# Altium schematic sheet hv_can.SchDoc: AcroIQ HV LED: CAN Interface
size A4; DocumentNumber: 3; Revision: A; SheetNumber: 4; SheetTotal: 4
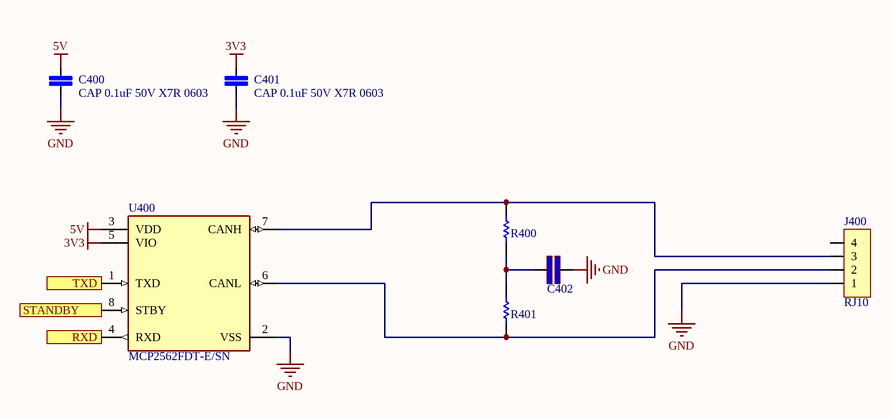
[diagram p0: hv_can.SchDoc]

## Parts
C400  CAP 0.1uF 50V X7R 0603  [FP-CL10-IPC_B]
C401  CAP 0.1uF 50V X7R 0603  [FP-CL10-IPC_B]
C402  CAP 4.7uF 50V X7R 1210  [CAPC3225X20N]  (value not drawn)
J400  RJ10  [0432024101]
R400  62R 1206 5%  [RESC3116X65X40ML10T20]  (value not drawn)
R401  62R 1206 5%  [RESC3116X65X40ML10T20]  (value not drawn)
U400  MCP2562FDT-E/SN  [FP-C04-057-SN-MFG]

## Ports
RXD, STANDBY, TXD

## Nets
3V3: C401.1 U400.5(VIO)
5V: C400.1 U400.3(VDD)
GND: C400.2 C401.2 C402.1 J400.1 U400.2(VSS)
RXD: U400.4(RXD) ; port RXD
STANDBY: U400.8(STBY) ; port STANDBY
TXD: U400.1(TXD) ; port TXD
NetC402_2: C402.2 R400.1 R401.2
NetJ400_2: J400.2 R401.1 U400.6(CANL)
NetJ400_3: J400.3 R400.2 U400.7(CANH)

Not connected (* = marked no-connect by the designer): J400 4

## Notes on the sheet
- Title
- Size:
- Date:
- A4
- Number:
- Time:
- Revision:
- Sheet
- of
- github.com/blueacro
- blueacro.com
- CERN OHL v1.2
- Made available under the
- File:
- © 2021 StackFoundry LLC. All Rights Reserved.

## Library data of the parts
C400 C401 = CMP-001-00084-4: Cap Ceramic 0.1uF 50V X7R 20% SMD 0603 125C Paper T/R
C402 = CMP-001-00083-2: CAP CER 4.7UF 50V X7R 1210; Tolerance: 10%; Material: Ceramic; Height: 1.8mm; Capacitance: 4.7uF; Contact Plating: Tin; Length: 3.2mm; Mount: Surface Mount; Dielectric: X7R; Case Code (Imperial): 1210; Min Operating Temperature: -55°C; Radiation Hardening: No; Lead Free: Lead Free; Max Operating Temperature: 125°C; Width: 0.098inch; Thickness: 0.079inch; Case/Package: 1210; Voltage Rating: 50V; Case Code (Metric): 3225; Voltage: 50V; Package Quantity: 1; Packaging: Tape and Reel; Depth: 2.5mm
J400 = CMP-167-0000-3: Modular Connectors / Ethernet Connectors RA 4/4 PORT 1 low profile; Number of Contacts: 4; Shielding: Unshielded; Connector Type: PCB; Pitch: 2.54mm; Current Rating: 1.5A; Number of Ports: 1; Contact Resistance: 10mR; Voltage Rating (DC): 125V; Glow Wire Compliant: Compliant; Gender: Female; Number of Circuits: 4; Orientation: Right Angle; Contact Material: Bronze; Number of Positions Loaded: 4; Length: 11.18mm; Min Operating Temperature: -40°C; Termination: Through Hole; Depth: 18.03mm; REACH SVHC: Unknown; Contact Plating: Gold; Number of Terminals: 4; Lead Free: Lead Free; Color: Black; Radiation Hardening: No; Mount: Through Hole; Max Operating Temperature: 85°C; Number of Positions: 4; Housing Color: Black; Flammability Rating: UL94 V-0; Packaging: Tray; Voltage Rating: 125V; Housing Material: Thermoplastic; Height: 11.58mm; Max Current Rating: 1.5A; Number of Rows: 1; Package Quantity: 2400
R400 R401 = CMP-009-00184-1: RES SMD 62 OHM 5% 1/4W 1206; Voltage Rating: 200V; Temperature Coefficient: 100ppm/°C; Power Rating: 250mW; Max Operating Temperature: 155°C; Features: Moisture Resistant; Depth: 1.6mm; Termination: SMD/SMT; Number of Terminations: 2; Military Standard: Not; Case Code (Metric): 3216; Lead Free: Lead Free; Length: 3.1mm; Package Quantity: 1; Voltage Rating (DC): 200V; Resistance: 62R; Case/Package: 1206; Tolerance: 5%; Case Code (Imperial): 1206; Height: 0.026inch; Packaging: Tape and Reel; Contact Plating: Tin,Matte; Min Operating Temperature: -55°C; Max Power Dissipation: 250mW; Radiation Hardening: No; Width: 0.063inch; Resistor Type: Thick Film
U400 = CMP-015-00009-1: IC TRANSCEIVER CAN FLEX 8SOIC; Data Rate: 8Mbps; Number of Transceivers: 1; Max Supply Voltage: 5.5V; Min Supply Voltage: 4.5V; Receiver Hysteresis: 200mV; Operating Supply Current: 70mA; Number of Pins: 8; Package Quantity: 3300; Case/Package: SOIC; Mount: Surface Mount; Min Operating Temperature: -40°C; Packaging: Tape and Reel; Max Operating Temperature: 125°C; Weight: 0.019048oz